# Altium schematic sheet Connectors.SchDoc
size A3
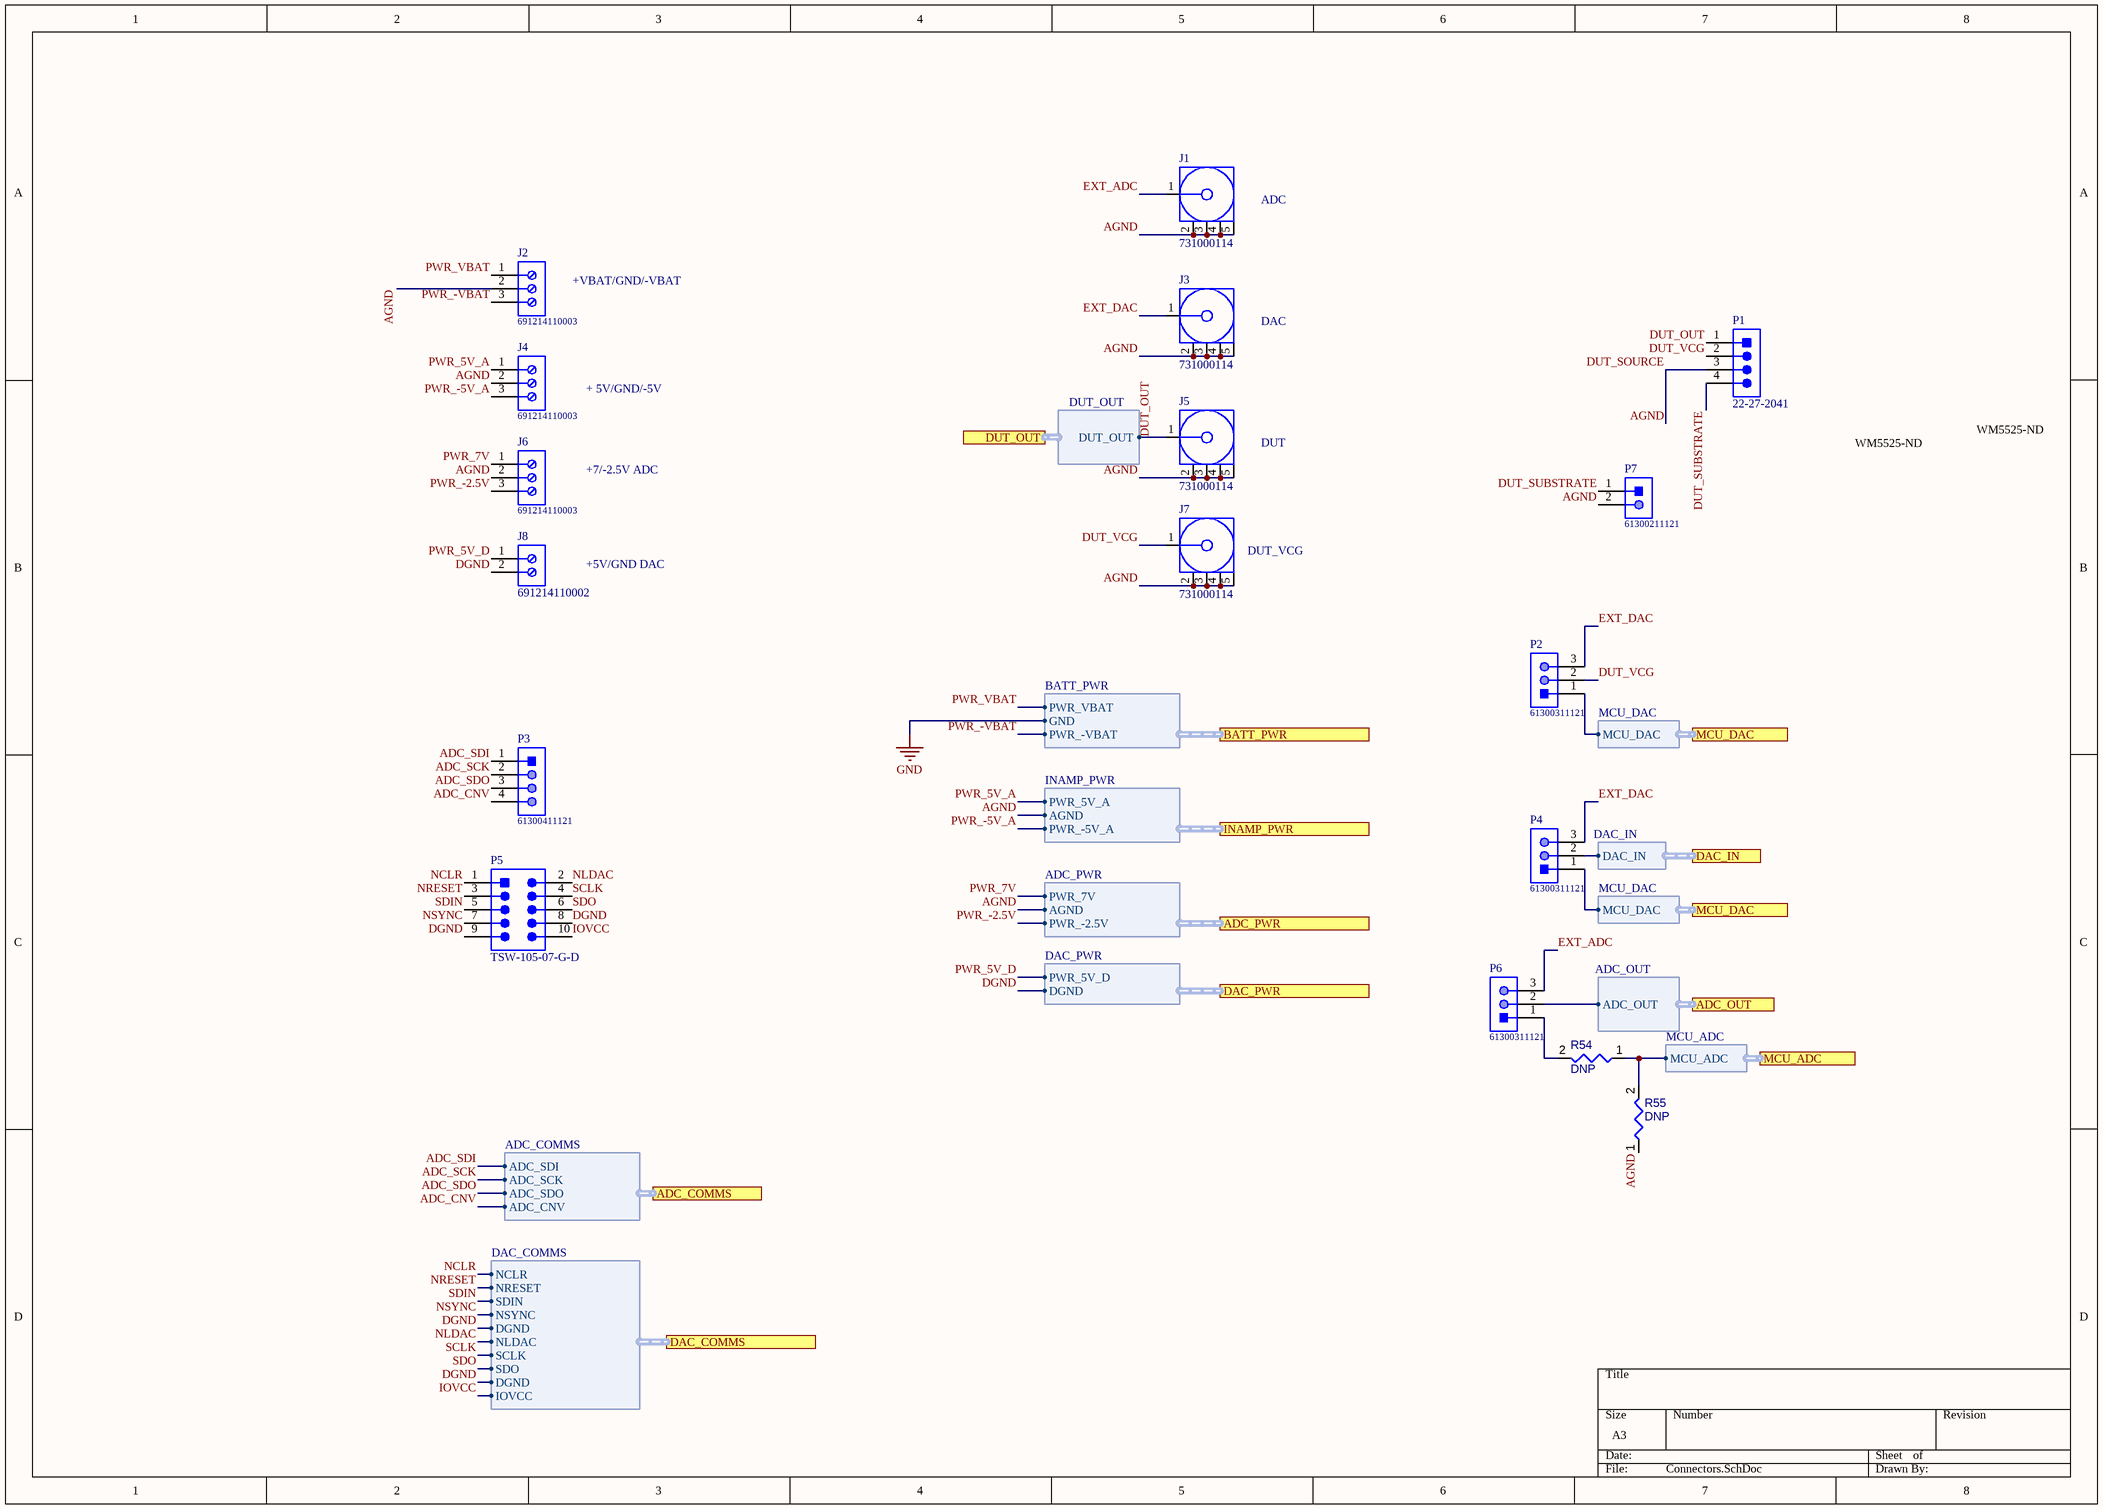
[diagram p0: Connectors.SchDoc]

## Parts
J1  731000114  [MOLX-731000114_V]
J2  691214110003  [691214110003]
J3  731000114  [MOLX-731000114_V]
J4  691214110003  [691214110003]
J5  731000114  [MOLX-731000114_V]
J6  691214110003  [691214110003]
J7  731000114  [MOLX-731000114_V]
J8  691214110002  [691214110002]
P1  22-27-2041  [MOLX-22-27-2041_V]
P2  61300311121  [61300311121]
P3  61300411121  [61300411121]
P4  61300311121  [61300311121]
P5  TSW-105-07-G-D  [SMTC-TSW-105-07-G-D_V]
P6  61300311121  [61300311121]
P7  61300211121  [61300211121]
R54  DNP  [RESC1608X55X25ML10T15]
R55  DNP  [RESC1608X55X25ML10T15]

## Ports
ADC_COMMS (harness ADC_COMMS), ADC_OUT (harness ADC_OUT), ADC_PWR (harness ADC_PWR), BATT_PWR (harness BATT_PWR), DAC_COMMS (harness DAC_COMMS), DAC_IN (harness DAC_IN), DAC_PWR (harness DAC_PWR), DUT_OUT (harness DUT_OUT), INAMP_PWR (harness INAMP_PWR), MCU_ADC (harness MCU_ADC), MCU_DAC (harness MCU_DAC)

## Harnesses
DUT_OUT: DUT_OUT
ADC_PWR: AGND, PWR_-2.5V, PWR_7V
DAC_COMMS: NCLR, NRESET, SDIN, DGND, NSYNC, NLDAC, SDO, SCLK, DGND, IOVCC
DAC_PWR: DGND, PWR_5V_D
INAMP_PWR: AGND, PWR_-5V_A, PWR_5V_A
BATT_PWR: GND, PWR_-VBAT, PWR_VBAT
ADC_COMMS: ADC_SCK, ADC_SDO, ADC_SDI, ADC_CNV
MCU_DAC: MCU_DAC
DAC_IN: DAC_IN
MCU_ADC: MCU_ADC
ADC_OUT: ADC_OUT

## Nets
GND: port BATT_PWR.GND
ADC_CNV: P3.4 ; port ADC_COMMS.ADC_CNV
ADC_SCK: P3.2 ; port ADC_COMMS.ADC_SCK
ADC_SDI: P3.1 ; port ADC_COMMS.ADC_SDI
ADC_SDO: P3.3 ; port ADC_COMMS.ADC_SDO
AGND: J1.2 J1.3 J1.4 J1.5 J2.2 J3.2 J3.3 J3.4 J3.5 J4.2 J5.2 J5.3 J5.4 J5.5 J6.2 J7.2 J7.3 J7.4 J7.5 P1.3 P7.2 R55.1 ; port ADC_PWR.AGND, port INAMP_PWR.AGND  [also labelled DUT_SOURCE]
DGND: J8.2 P5.8 P5.9 ; port DAC_COMMS.DGND, port DAC_PWR.DGND
DUT_OUT: J5.1 P1.1 ; port DUT_OUT.DUT_OUT
DUT_SUBSTRATE: P1.4 P7.1
DUT_VCG: J7.1 P1.2 P2.2
EXT_ADC: J1.1 P6.3
EXT_DAC: J3.1 P2.3 P4.3
IOVCC: P5.10 ; port DAC_COMMS.IOVCC
NCLR: P5.1 ; port DAC_COMMS.NCLR
NLDAC: P5.2 ; port DAC_COMMS.NLDAC
NRESET: P5.3 ; port DAC_COMMS.NRESET
NSYNC: P5.7 ; port DAC_COMMS.NSYNC
PWR_5V_A: J4.1 ; port INAMP_PWR.PWR_5V_A
PWR_5V_D: J8.1 ; port DAC_PWR.PWR_5V_D
PWR_7V: J6.1 ; port ADC_PWR.PWR_7V
PWR_-2.5V: J6.3 ; port ADC_PWR.PWR_-2.5V
PWR_-5V_A: J4.3 ; port INAMP_PWR.PWR_-5V_A
PWR_-VBAT: J2.3 ; port BATT_PWR.PWR_-VBAT
PWR_VBAT: J2.1 ; port BATT_PWR.PWR_VBAT
SCLK: P5.4 ; port DAC_COMMS.SCLK
SDIN: P5.5 ; port DAC_COMMS.SDIN
SDO: P5.6 ; port DAC_COMMS.SDO
NetP2_1: P2.1 P4.1 ; port MCU_DAC.MCU_DAC
NetP4_2: P4.2 ; port DAC_IN.DAC_IN
NetP6_1: P6.1 R54.2
NetP6_2: P6.2 ; port ADC_OUT.ADC_OUT
NetR54_1: R54.1 R55.2 ; port MCU_ADC.MCU_ADC

## Notes on the sheet
- (near J1) ADC
- +VBAT/GND/-VBAT
- (near J3) DAC
- + 5V/GND/-5V
- (near J5) DUT
- WM5525-ND
- +7/-2.5V ADC
- +5V/GND DAC
- (near J7) DUT_VCG

## Library data of the parts
J1 J3 J5 J7 = CMP-2000-05487-1: SMA Right-Angle PCB Jack Receptacle, Brass Body, Gold Plated, 50 Ohm, 5-Pin THD, RoHS, Tray; Manufacturer: Molex; Datasheet Version: 09/2016; Package Description: 5-Pin Through Hole Device, Body 14.8 x 6.35 mm, Pitch 2.54 mm; Datasheet URL: http://www.molex.com/webdocs/datasheets/pdf/en-us/0731000114_RF_COAX_CONNECTORS.pdf; Manufacturer URL: http://www.molex.com/; Package Reference: 731000114; Mounting Technology: ThroughHole; Package URL: http://www.molex.com/pdm_docs/sd/731000114_sd.pdf; Supplier 1: Digi-Key; Supplier Part Number 1: WM5525-ND; Supplier Unit Price 1: 5.07000
J2 J4 J6 = CMP-1502-02466-1: Serie 2141 - 3.50 mm Horizontal Entry Modular with Rising Cage Clamp WR-TBL, 3 pin; Manufacturer: Wurth Elektronik; Pin Number: 3; Pitch: 3.50mm; Package Reference: 691214110003; Mounting Technology: THT; Part Number: 691214110003; Manufacturer URL: http://www.we-online.de; Packaging: Box; Operating Temperature: -40to105degC; Publisher: WurthElektronik; Datasheet URL: http://katalog.we-online.de/em/datasheet/6912141100xx.pdf
J8 = CMP-1502-02464-1: Serie 2141 - 3.50 mm Horizontal Entry Modular with Rising Cage Clamp WR-TBL, 2 pin; Manufacturer: Wurth Elektronik; Pin Number: 2; Pitch: 3.50mm; Datasheet URL: http://katalog.we-online.de/em/datasheet/6912141100xx.pdf; Packaging: Box; Mounting Technology: THT; Package Reference: 691214110002; Manufacturer URL: http://www.we-online.de; Part Number: 691214110002; Publisher: WurthElektronik; Operating Temperature: -40to105degC
P1 = CMP-2000-05243-1: Male Header, Pitch 2.54 mm, 1 x 4 Position, Height 11.7 mm, Tail Length 3.56 mm, RoHS, Bulk; Manufacturer: Molex; Voltage rating: 250V; Current rating: 4A; Datasheet Version: Rev. F, 06/2009; Operating temperature: 0degCto+75degC; Contact material: Tinplatedbrass; Manufacturer URL: http://www.molex.com/; Housing material: Nylon(UL94V-0); Datasheet URL: http://www.molex.com/pdm_docs/sd/022272041_sd.pdf; Supplier 1: Digi-Key; Supplier Part Number 1: WM4113-ND; Supplier Unit Price 1: 0.40000
P2 P4 P6 = CMP-1502-01062-1: THT Vertical Pin Header WR-PHD, Pitch 2.54 mm, Single Row, 3 pins; Manufacturer: Wurth Elektronik; Withstanding Voltage: 500VAC; Working Voltage: 250VAC; Rated Current: 3A; Pitch: 2.54mm; Pin Number: 3; Gender: Male; Contact Resistance: 20mOhm; Package Reference: 61300311121; Manufacturer URL: http://www.we-online.de; Datasheet URL: https://katalog.we-online.de/em/datasheet/6130xx11121.pdf; Operating Temperature: -40to105degC; Part Number: 61300311121; Orientation: Vertical; Packaging: Bag; Row Number: Single; Mounting Technology: THT; Publisher: WurthElektronik
P3 = CMP-1502-01064-1: THT Vertical Pin Header WR-PHD, Pitch 2.54 mm, Single Row, 4 pins; Manufacturer: Wurth Elektronik; Withstanding Voltage: 500VAC; Rated Current: 3A; Working Voltage: 250VAC; Pin Number: 4; Gender: Male; Contact Resistance: 20mOhm; Pitch: 2.54mm; Manufacturer URL: http://www.we-online.de; Operating Temperature: -40to105degC; Packaging: Bag; Mounting Technology: THT; Package Reference: 61300411121; Datasheet URL: https://katalog.we-online.de/em/datasheet/6130xx11121.pdf; Publisher: WurthElektronik; Part Number: 61300411121; Row Number: Single; Orientation: Vertical
P5 = CMP-2000-07330-1: Post Terminal Strip Assembly, Pitch 2.54 mm, 2 x 5 Position, Height 8.58 mm, Tail Length 2.54 mm, -55 to 125 degC, RoHS, Bulk; Manufacturer: Samtec-Inc.; Connector Type: Header,Unshrouded; Number of Positions Loaded: All; Pitch: 0.100"(2.54mm); Number of Positions: 10; Package Reference: TSW-105-07-G-D; Mounting Technology: ThroughHole; Datasheet URL: http://suddendocs.samtec.com/prints/tsw-xxx-xx-xxx-x-xx-xxx-mkt.pdf; Termination: Solder; Packaging: Bulk; Number of Rows: 2; Contact Finish: Gold; Mounting Type: ThroughHole; Features: -; Color: Black; Category: Connectors,Interconnects; Family: RectangularConnectors-Headers,MalePins; Manufacturer URL: http://www.samtec.com/; Series: TSW; Fastening Type: -; Package URL: http://suddendocs.samtec.com/prints/tsw-xxx-xx-x-x-xx-xxx-footprint.pdf; Row Spacing: 0.100"(2.54mm); Contact Mating Length: 0.230"(5.84mm); Contact Finish Thickness: 10µin(0.25µm); Contact Type: MalePin; Package Description: Male Header, Pitch 2.54 mm, 2 x 5 Position, Height 8.58 mm, Tail Length 2.54 mm; Datasheet Version: Rev. DO, 08/1988
P7 = CMP-1502-01060-1: THT Vertical Pin Header WR-PHD, Pitch 2.54 mm, Single Row, 2 pins; Manufacturer: Wurth Elektronik; Rated Current: 3A; Gender: Male; Withstanding Voltage: 500VAC; Working Voltage: 250VAC; Pitch: 2.54mm; Contact Resistance: 20mOhm; Pin Number: 2; Mounting Technology: THT; Orientation: Vertical; Operating Temperature: -40to105degC; Packaging: Bag; Publisher: WurthElektronik; Datasheet URL: https://katalog.we-online.de/em/datasheet/6130xx11121.pdf; Manufacturer URL: http://www.we-online.de; Row Number: Single; Package Reference: 61300211121; Part Number: 61300211121
R54 R55 = CMP-009-00023-4: do not place